# Altium schematic sheet 01_Overview.SchDoc
size A4; SheetNumber: 2; SheetTotal: 4
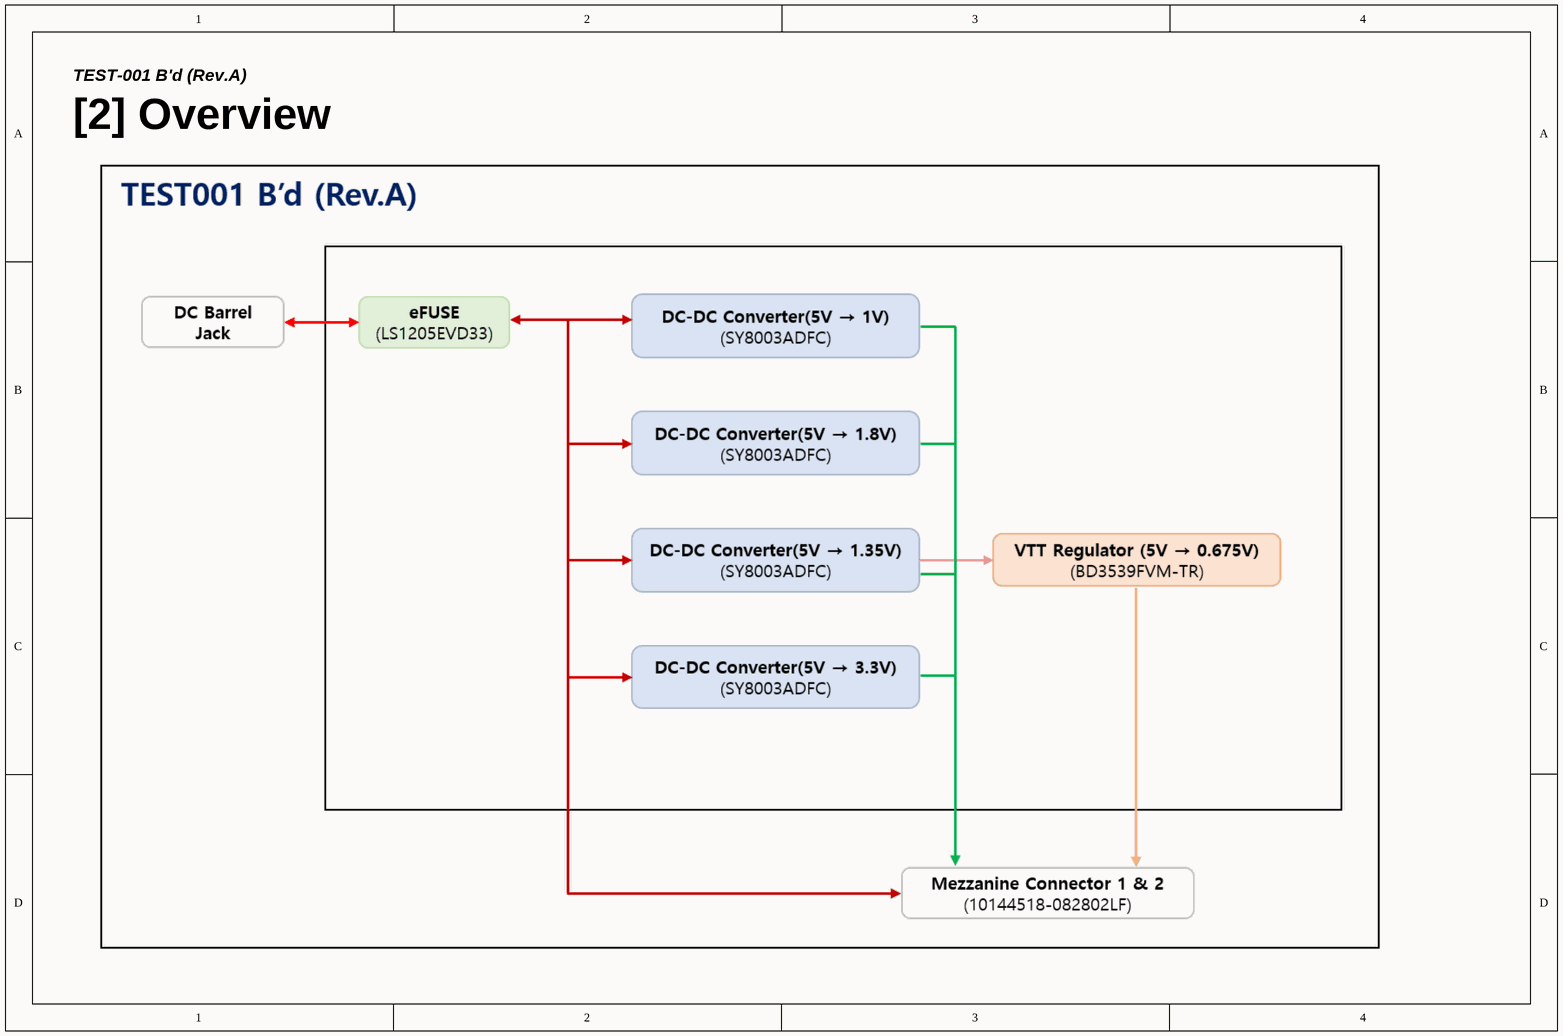
[diagram p0: 01_Overview.SchDoc]

## Notes on the sheet
- TEST-001 B'd (Rev.A)
- [2] Overview
- Title
- Rev
- Doc
- Sheet #
- of
- Author
- This document is copyright of ArkX and shall not be revealed, produced, copied, in whole or in part,
- Date
- nor used for any purpose other than submitted.